# EAGLE design eurorack-passive-logic-or (EAGLE 9.6.2)
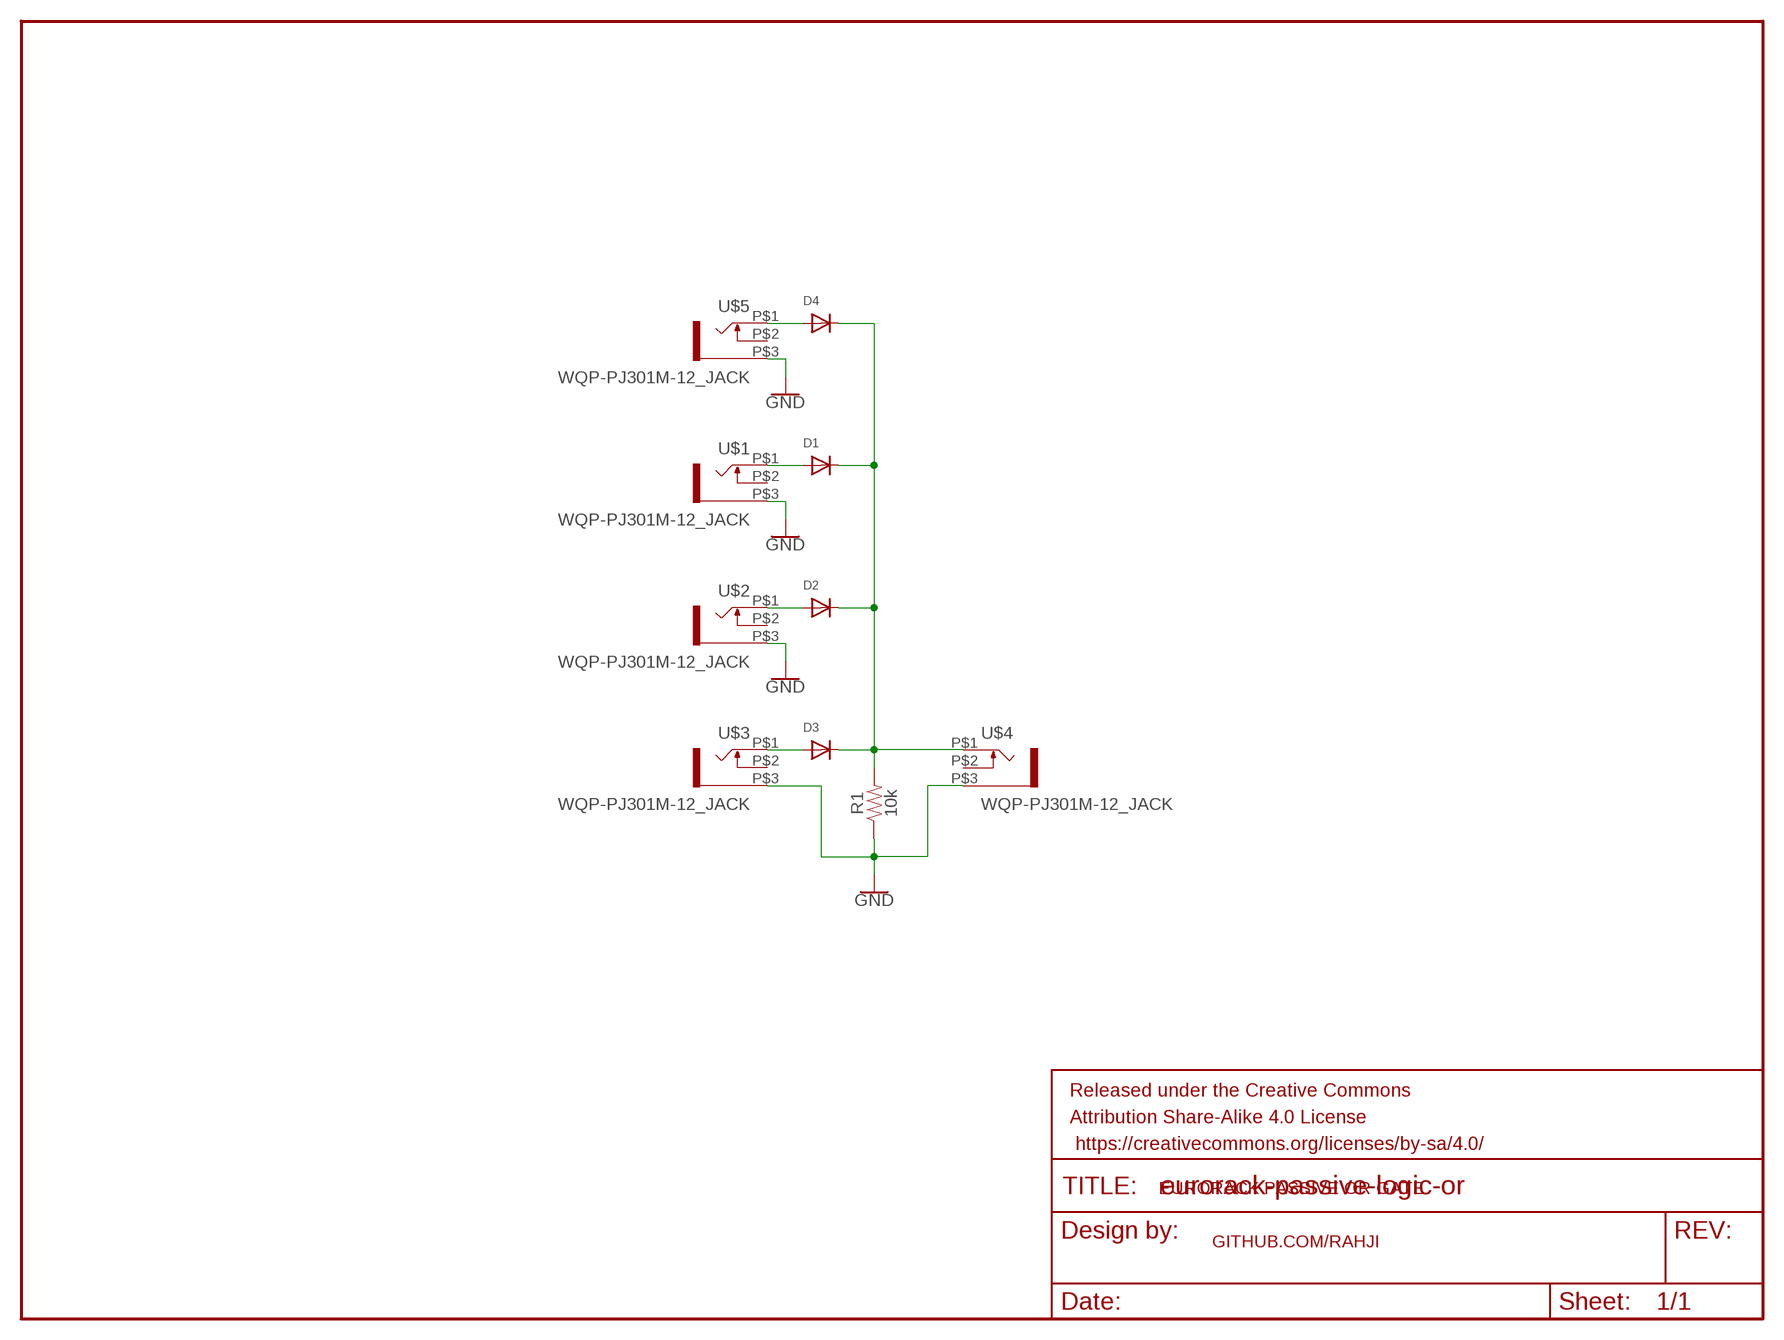
[diagram p0: schematic, sheet 1]

## Parts
D1  DIODEDO-1N4148  [DO-1N4148]
D2  DIODEDO-1N4148  [DO-1N4148]
D3  DIODEDO-1N4148  [DO-1N4148]
D4  DIODEDO-1N4148  [DO-1N4148]
FRAME1  FRAME-LETTERNO_PACKAGE  [DUMMY]
R1  10k  10KOHM-HORIZ_KIT-1/4W-5%  [AXIAL-0.3-KIT]
U$1  WQP-PJ301M-12_JACK  [WQP-PJ301M-12_JACK]
U$2  WQP-PJ301M-12_JACK  [WQP-PJ301M-12_JACK]
U$3  WQP-PJ301M-12_JACK  [WQP-PJ301M-12_JACK]
U$4  WQP-PJ301M-12_JACK  [WQP-PJ301M-12_JACK]
U$5  WQP-PJ301M-12_JACK  [WQP-PJ301M-12_JACK]

## Nets
GND: R1.P$1 U$1.P$3 U$2.P$3 U$3.P$3 U$4.P$3 U$5.P$3
N$1: D1.A U$1.P$1
N$2: D2.A U$2.P$1
N$3: D3.A U$3.P$1
N$4: D4.A U$5.P$1
N$5: D1.C D2.C D3.C D4.C R1.P$2 U$4.P$1
Unconnected: U$1.P$2 U$2.P$2 U$3.P$2 U$4.P$2 U$5.P$2

## Notes on the sheet
- EURORACK PASSIVE OR GATE
- GITHUB.COM/RAHJI

## Library data of the parts
D1-D4 = adafruit:DIODE: Diode SMADIODE - SMA Surface Mount Package 20V 1A Schottky Diode Digikey: 641-1014-6-ND DO-1N4148 - Through Hole Small Current Diode SOD-123 20V 1 A (.5mV Vf) Schottky Diode - Digikey: MBRX120TPMSCT-ND SOD-323 10V 570mA (.38mV Vf, 3ns) Schottky Diode - Digikey: ZLLS410CT-ND SOD-523 30V 30mA Schottky Diode (RB751S-40TE61) - Digikey: RB751S-40TE61CT-ND SOT23-R/W - SOT23 Package (R = Solder Paste/Reflow Ovens, W = Hand-Soldering) BAT54Film 40V 300mA - Digikey: 497-7162-1-ND
FRAME1 = SparkFun-Aesthetics:FRAME-LETTER: Schematic Frame - Letter Standard 8.5x11 US Letter frame; DESIGNER: Nobody; VERSION: v01
R1 = SparkFun-Resistors:10KOHM: 10kΩ resistor A resistor is a passive two-terminal electrical component that implements electrical resistance as a circuit element. Resistors act to reduce current flow, and, at the same time, act to lower voltage levels within circuits. - Wikipedia; PROD_ID: RES-09435
U$1-U$5 = thonkiconn:WQP-PJ301M-12_JACK

## Board
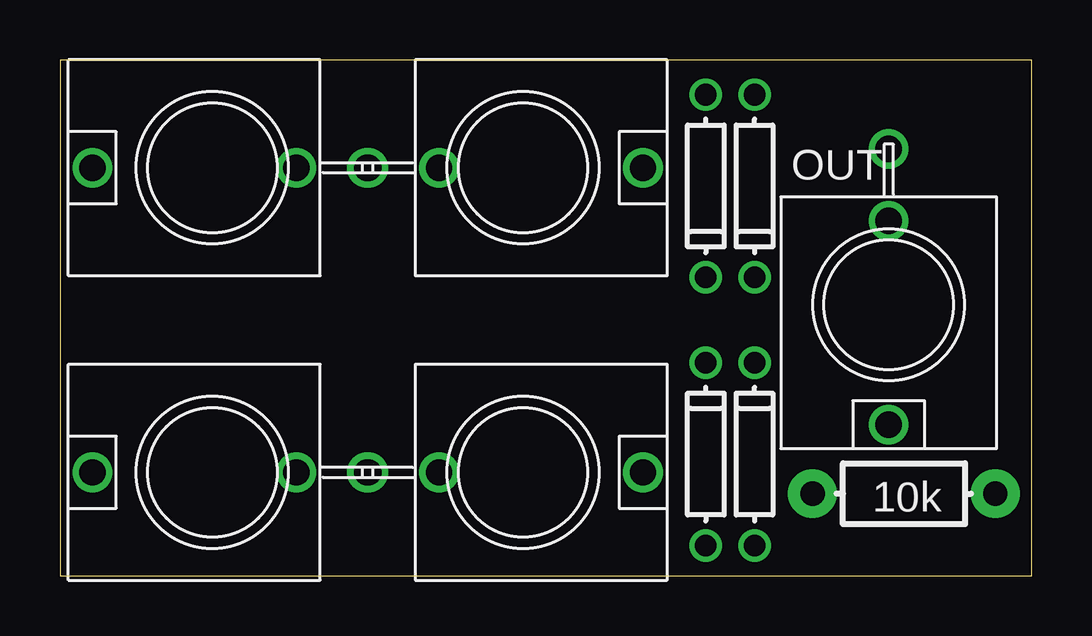
[diagram p1: board, top side]
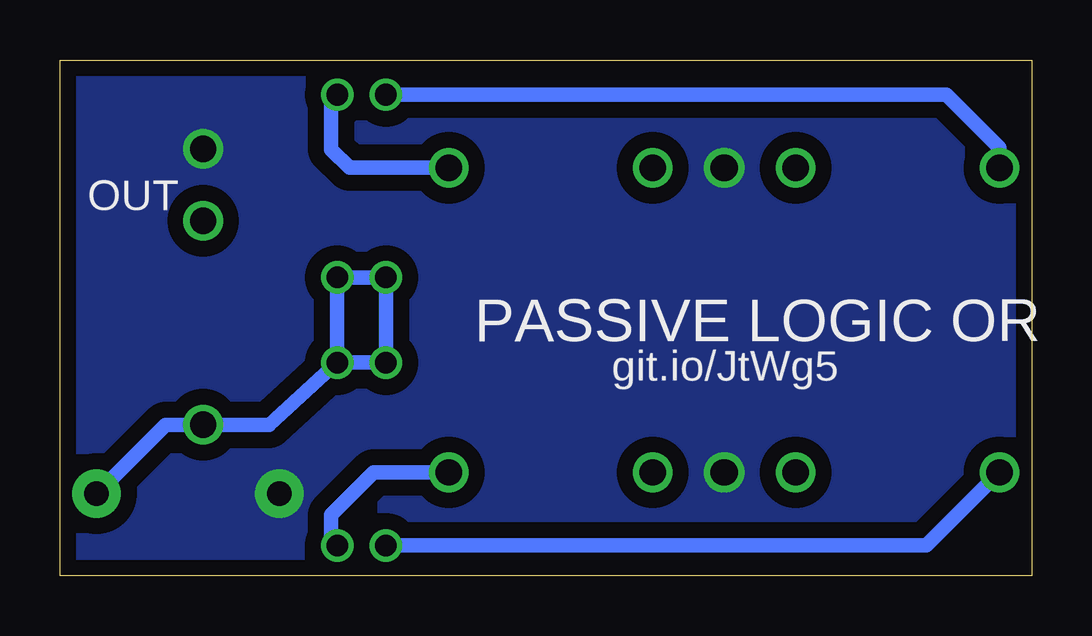
[diagram p2: board, bottom side, seen from below]

Size 40.51 x 21.51 mm. Coordinates in mm from the lower left corner, seen from the top.
Outline: 0,0 40.51,0 40.51,21.51 0,21.51 0,0
Copper layers (1*16): Top 0.0356mm / dielectric 1.5011mm / Bottom 0.0356mm
Design rules "oshpark-2layer": minimum track width 6mil, minimum drill 13mil, track to track 6mil, track to pad 6mil, pad to pad 6mil, via to via 6mil, smd to smd 6mil, copper to edge 15mil, drill to drill 6mil, minimum pad ring 7mil, minimum via ring 7mil, stop-mask expansion 2.5mil, vias tented up to drill 0mil, thermal gap 10mil

### Footprints (pad centres in the part's own frame; a part is rotated, then mirrored left to right if it is on the bottom)
DO-1N4148 = drill 0.9: A -3.81,0; C 3.81,0
AXIAL-0.3-KIT = drill 1.016 pad 2.032: P$1 -3.81,0; P$2 3.81,0
WQP-PJ301M-12_JACK = drill 1.1: P$1 0,5; P$2 0,-3.5; P$3 0,-6.5

### Placement (x,y rotation side)
D1  26.92,5.08 90 top
D2  26.92,16.26 270 top
D3  28.96,16.26 270 top
D4  28.96,5.08 90 top
FRAME1  -5.08,-2.54 0 top  (outside the outline)
R1  35.18,3.43 0 top
U$1  6.35,4.32 90 top
U$2  6.35,17.02 90 top
U$3  19.3,17.02 270 top
U$4  34.54,11.3 180 top
U$5  19.3,4.32 270 top

### Tracks (layer width: path | path; a pad name or v marks a point on that pad's centre or on a via)
GND
  pour Bottom (isolate 0.66, no thermals): -4.95,22.86 42.04,22.86 42.04,-1.27 -4.95,-1.27
N$1
  Bottom 0.61: D1.A 4.4,1.27 U$1.P$1
N$2
  Bottom 0.61: D2.A 3.56,20.07 1.35,17.86 U$2.P$1
N$3
  Bottom 0.61: U$3.P$1 28.45,17.02 29.21,17.78 29.21,19.81 D3.A
N$4
  Bottom 0.61: U$5.P$1 27.43,4.32 29.21,2.54 29.21,1.52 D4.A
N$5
  Bottom 0.61: R1.P$2 36.11,6.3 U$4.P$1 31.8,6.3 D4.C | D4.C D1.C D2.C D3.C D4.C

### Text on the board
tNames: OUT
bNames: OUT | PASSIVE LOGIC OR | git.io/JtWg5